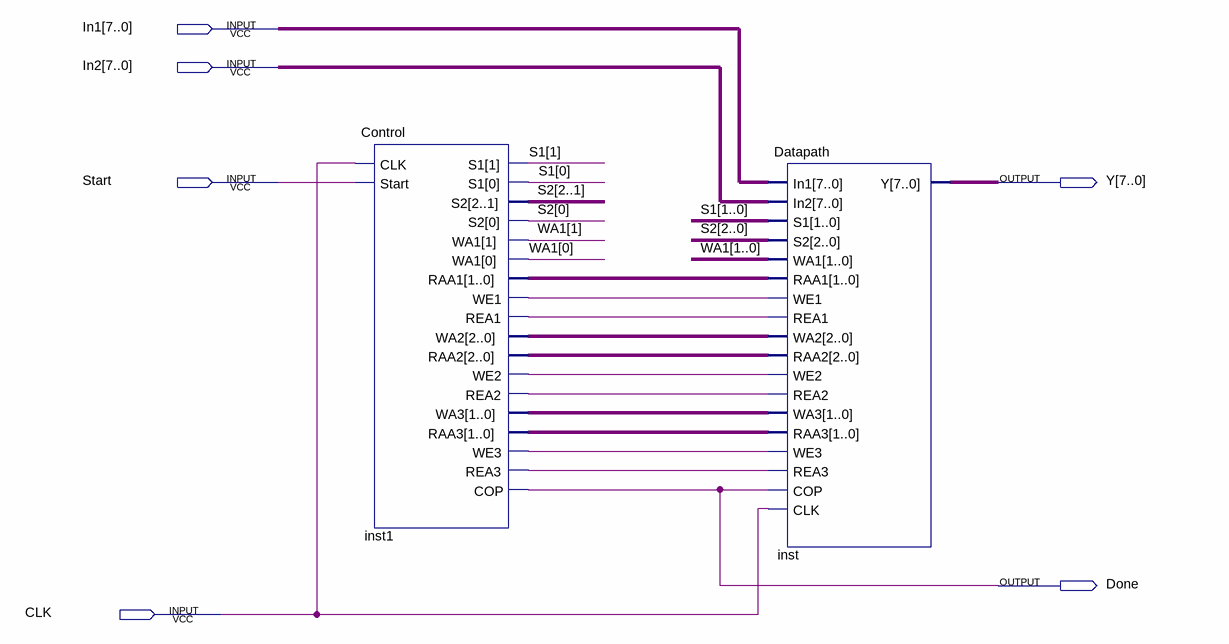
[diagram p0: schematic sheet]
// Quartus schematic Bai1.bdf as structural Verilog: 2 symbols, 6 pins
module Bai1 (
  input  [7:0] In1,
  input  [7:0] In2,
  input  Start,
  input  CLK,
  output [7:0] Y,
  output Done
);

  wire inst1_rea1, inst1_rea2, inst1_rea3, inst1_we1, inst1_we2, inst1_we3;
  wire [1:0] inst1_raa1, inst1_raa3, inst1_wa3, S1, WA1;
  wire [2:0] inst1_raa2, inst1_wa2, S2;

  Control inst1 (
    .CLK(CLK), .Start(Start), .S1(S1), .S2(S2), .WA1(WA1), .RAA1(inst1_raa1), .WE1(inst1_we1),
    .REA1(inst1_rea1), .WA2(inst1_wa2), .RAA2(inst1_raa2), .WE2(inst1_we2), .REA2(inst1_rea2),
    .WA3(inst1_wa3), .RAA3(inst1_raa3), .WE3(inst1_we3), .REA3(inst1_rea3), .COP(Done));
  Datapath inst (
    .In1(In1), .In2(In2), .S1(S1), .S2(S2), .WA1(WA1), .RAA1(inst1_raa1), .WE1(inst1_we1), .REA1(inst1_rea1),
    .WA2(inst1_wa2), .RAA2(inst1_raa2), .WE2(inst1_we2), .REA2(inst1_rea2), .WA3(inst1_wa3),
    .RAA3(inst1_raa3), .WE3(inst1_we3), .REA3(inst1_rea3), .COP(Done), .CLK(CLK), .Y(Y));
endmodule
